# Altium schematic sheet iskra.SchDoc
size 420 x 297 mm; Address1: Address1; Address2: Address2; Address3: Address3; Address4: Address4; DocumentNumber: РКВТ1488 Э3; SheetNumber: 1; Scale: 1:1; DocumentType: Схема электрическая принципиальная; FirstReferrence: АБВГ.123456.001
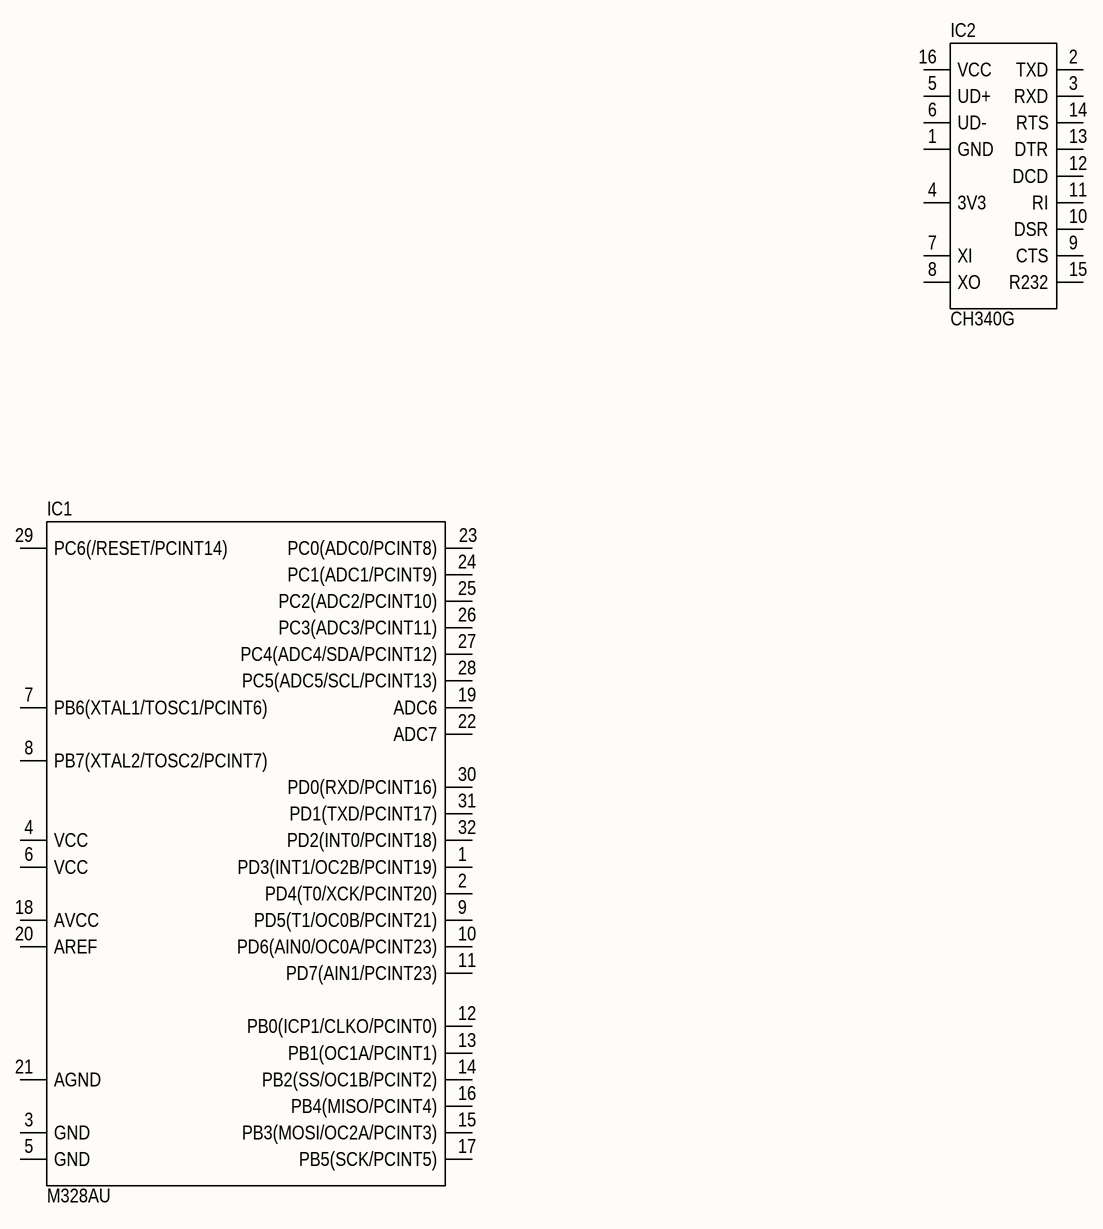
[diagram p0: iskra.SchDoc]

## Parts
IC1  M328AU
IC2  CH340G

## Nets

Not connected (* = marked no-connect by the designer): IC1 1(PD3(INT1/OC2B/PCINT19)) 2(PD4(T0/XCK/PCINT20)) 3(GND) 4(VCC) 5(GND) 6(VCC) 7(PB6(XTAL1/TOSC1/PCINT6)) 8(PB7(XTAL2/TOSC2/PCINT7)) 9(PD5(T1/OC0B/PCINT21)) 10(PD6(AIN0/OC0A/PCINT23)) 11(PD7(AIN1/PCINT23)) 12(PB0(ICP1/CLKO/PCINT0)) 13(PB1(OC1A/PCINT1)) 14(PB2(SS/OC1B/PCINT2)) 15(PB3(MOSI/OC2A/PCINT3)) 16(PB4(MISO/PCINT4)) 17(PB5(SCK/PCINT5)) 18(AVCC) 19(ADC6) 20(AREF) 21(AGND) 22(ADC7) 23(PC0(ADC0/PCINT8)) 24(PC1(ADC1/PCINT9)) 25(PC2(ADC2/PCINT10)) 26(PC3(ADC3/PCINT11)) 27(PC4(ADC4/SDA/PCINT12)) 28(PC5(ADC5/SCL/PCINT13)) 29(PC6(/RESET/PCINT14)) 30(PD0(RXD/PCINT16)) 31(PD1(TXD/PCINT17)) 32(PD2(INT0/PCINT18)); IC2 1(GND) 2(TXD) 3(RXD) 4(3V3) 5(UD+) 6(UD-) 7(XI) 8(XO) 9(CTS) 10(DSR) 11(RI) 12(DCD) 13(DTR) 14(RTS) 15(R232) 16(VCC)

## Notes on the sheet
- Перв. примен.
- Справ. №
- Подп. и дата
- Инв. № дубл.
- Взам. инв. №
- Разраб.
- Изм.
- Лист
- № докум.
- Подп.
- Дата
- Лит.
- Масса
- Масштаб
- Пров.
- Т.контр.
- Листов
- Инв. № подл.
- Утв.
- Н.контр.
- 2.106-A3
- Копировал
- Формат А3

## Library data of the parts
IC1 = M328AU_1: Model: *
IC2 = CH340G_1